# EAGLE design XMEGAbreakoutSMD (EAGLE 7.5.0)
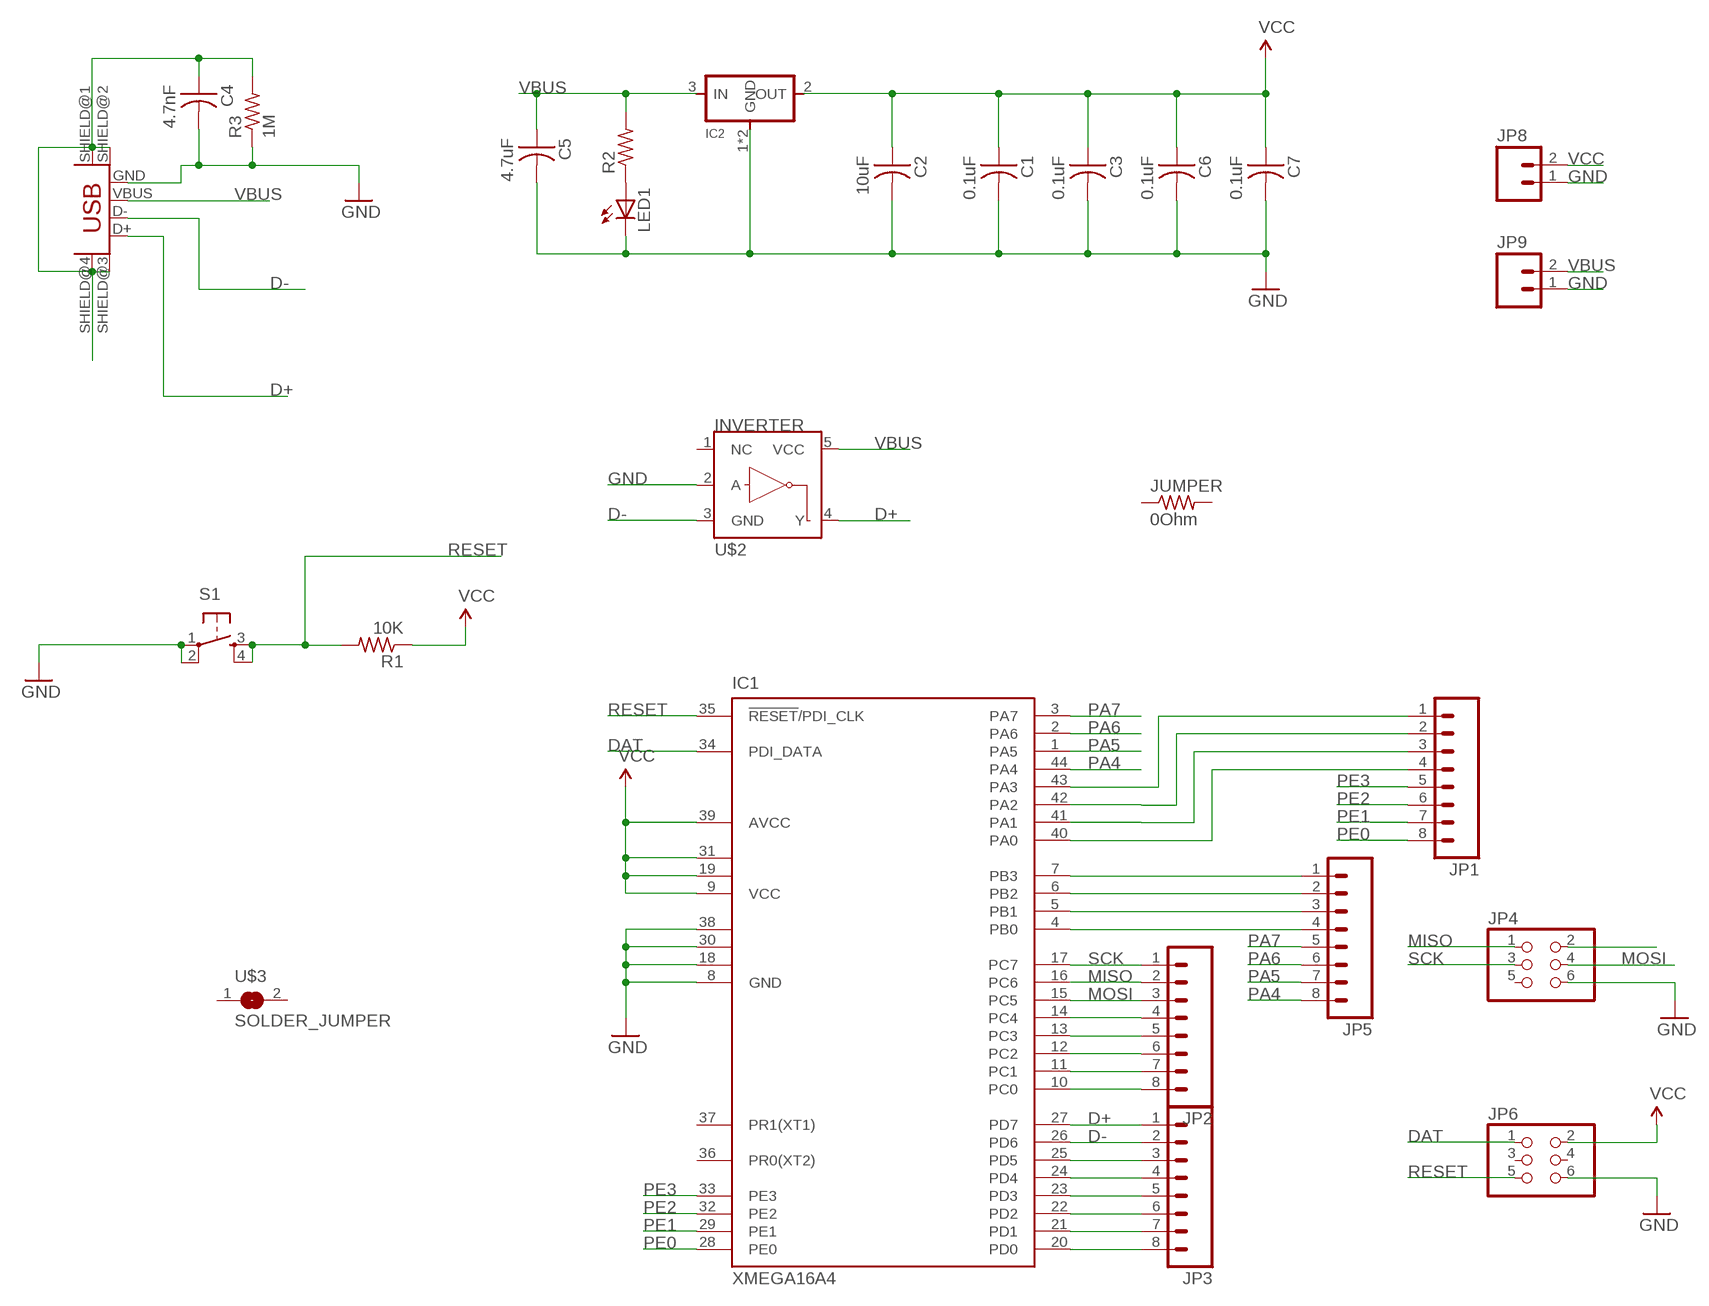
[diagram p0: schematic, sheet 1]

## Parts
C1  0.1uF  CAP-US1206  [C1206]
C2  10uF  CAP-US1206  [C1206]
C3  0.1uF  CAP-US1206FAB  [C1206FAB]
C4  4.7nF  CAP-US1206  [C1206]
C5  4.7uF  CAP-US1206  [C1206]
C6  0.1uF  CAP-US1206  [C1206]
C7  0.1uF  CAP-US1206  [C1206]
IC1  XMEGA16A4  [TQFP44-FAB]
IC2  REGULATORSOT223  [SOT223]
JP1  M08  [1X08_SMD_ALT_2X1X4]
JP2  M08SMD-STRAIGHT-ALT  [1X08_SMD_ALT]
JP3  M08SMD-STRAIGHT-ALT  [1X08_SMD_ALT]
JP4  PINHD-2X3-SMD  [2X03SMD]
JP5  M08SMD-STRAIGHT-ALT  [1X08_SMD_ALT]
JP6  PINHD-2X3-SMD  [2X03SMD]
JP8  M02  [1X02_SMD_STRAIGHT_ALT]
JP9  M02  [1X02_SMD_STRAIGHT_ALT]
JUMPER  0Ohm  RES-US1206FAB  [R1206FAB]
LED1  LEDSMT1206  [1206]
R1  10K  RES-US1206FAB  [R1206FAB]
R2  RES-US1206FAB  [R1206FAB]
R3  1M  RES-US1206FAB  [R1206FAB]
S1  6MM_SWITCH6MM_SWITCH  [6MM_SWITCH]
U$1  USB_MINIB  [USB_MINIB]
U$2  INVERTER  [SOT23-5]
U$3  SOLDER_JUMPER  [SJFAB]

## Nets
D+: IC1.27(PD7) JP3.1 U$1.D+ U$2.4(Y)
D-: IC1.26(PD6) JP3.2 U$1.D- U$2.3(GND)
DAT: IC1.34(PDI_DATA) JP6.1
GND: C1.2 C2.2 C3.2 C4.2 C5.2 C6.2 C7.2 IC1.8(GND) IC1.18(GND1) IC1.30(GND2) IC1.38(GND3) IC2.1(GND) IC2.4(GND) JP4.6 JP6.6 JP8.1 JP9.1 LED1.C R3.1 S1.1(P) S1.2(P1) U$1.GND U$2.2(A)
MISO: IC1.16(PC6) JP2.2 JP4.1
MOSI: IC1.15(PC5) JP2.3 JP4.4
N$5: IC1.43(PA3) JP1.1
N$6: IC1.42(PA2) JP1.2
N$7: IC1.41(PA1) JP1.3
N$8: IC1.40(PA0) JP1.4
N$9: IC1.7(PB3) JP5.1
N$10: IC1.6(PB2) JP5.2
N$11: IC1.5(PB1) JP5.3
N$12: IC1.14(PC4) JP2.4
N$13: IC1.13(PC3) JP2.5
N$14: IC1.12(PC2) JP2.6
N$15: IC1.11(PC1) JP2.7
N$16: IC1.10(PC0) JP2.8
N$17: JP4.2
N$18: IC1.4(PB0) JP5.4
N$19: IC1.25(PD5) JP3.3
N$20: IC1.24(PD4) JP3.4
N$21: IC1.23(PD3) JP3.5
N$22: IC1.22(PD2) JP3.6
N$23: IC1.21(PD1) JP3.7
N$24: IC1.20(PD0) JP3.8
N$25: C4.1 R3.2 U$1.SHIELD@1(SHIELD) U$1.SHIELD@2(SHIELD1) U$1.SHIELD@3(SHIELD2) U$1.SHIELD@4(SHIELD3)
N$26: LED1.A R2.1
PA4: IC1.44(PA4) JP5.8
PA5: IC1.1(PA5) JP5.7
PA6: IC1.2(PA6) JP5.6
PA7: IC1.3(PA7) JP5.5
PE0: IC1.28(PE0) JP1.8
PE1: IC1.29(PE1) JP1.7
PE2: IC1.32(PE2) JP1.6
PE3: IC1.33(PE3) JP1.5
RESET: IC1.35(!RESET!/PDI_CLK) JP6.5 R1.2 S1.3(S) S1.4(S1)
SCK: IC1.17(PC7) JP2.1 JP4.3
VBUS: C5.1 IC2.3(IN) JP9.2 R2.2 U$1.VBUS U$2.5(VCC)
VCC: C1.1 C2.1 C3.1 C6.1 C7.1 IC1.9(VCC) IC1.19(VCC1) IC1.31(VCC2) IC1.39(AVCC) IC2.2(OUT) JP6.2 JP8.2 R1.1
Unconnected: IC1.36(PR0(XT2)) IC1.37(PR1(XT1)) JP4.5 JP6.3 JP6.4 JUMPER.1 JUMPER.2 U$2.1(NC) U$3.1 U$3.2

## Library data of the parts
C1-C7 = fab:CAP-US
IC1 = atmel:XMEGA16A4: MICROCONTROLLER Features High-performance, Low-power 8/16-bit AVR XMEGA Microcontroller Non-Volatile Program and Data Memories - 16 KB - 128 KB of In-System Self-Programmable Flash - 4 KB - 8 KB Boot Code Section with Independent Lock Bits - 1 KB - 2 KB EEPROM - 2 KB - 8 KB Internal SRAM Peripheral Features - Four-channel DMA Controller with support for external requests - Eight-channel Event System - Five 16-bit Timer/Counters Three Timer/Counters with 4 Output Compare or Input Capture channels Two Timer/Counters with 2 Output Compare or Input Capture channels High-Resolution Extensions on all Timer/Counters Advanced Waveform Extension on one Timer/Counter - Five USARTs IrDA Extension on one USART - Two Two-Wire Interfaces with dual address match (I2C and SMBus compatible) - Two SPIs (Serial Peripheral Interfaces) peripherals - AES and DES Crypto Engine - 16-bit Real Time Counter with Separate Oscillator - One Twelve-channel, 12-bit, 2 Msps Analog to Digital Converter - One Two-channel, 12-bit, 1 Msps Digital to Analog Converter - Two Analog Comparators with Window compare function - External Interrupts on all General Purpose I/O pins - Programmable Watchdog Timer with Separate On-chip Ultra Low Power Oscillator Special Microcontroller Features - Power-on Reset and Programmable Brown-out Detection - Internal and External Clock Options with PLL - Programmable Multi-level Interrupt Controller - Sleep Modes: Idle, Power-down, Standby, Power-save, Extended Standby - Advanced Programming, Test and Debugging Interfaces PDI (Program and Debug Interface) for programming, test and debugging I/O and Packages - 34 Programmable I/O Lines - 44 - lead TQFP - 44 - pad VQFN/QFN - 49 - ball VFBGA Operating Voltage - 1.6 - 3.6V Speed performance - 0 - 12 MHz @ 1.6 - 3.6V - 0 - 32 MHz @ 2.7 - 3.6V Drawn by Dipl.-Ing. (FH) Robert Siegler Created: 27.05.09
IC2 = fab:REGULATOR
JP1-JP3 JP5 = SparkFun:M08: Header 8 Standard 8-pin 0.1" header. Use with straight break away headers (SKU : PRT-00116), right angle break away headers (PRT-00553), swiss pins (PRT-00743), machine pins (PRT-00117), and female headers (PRT-00115).
JP4 JP6 = fab:PINHD-2X3-SMD: PIN HEADER
JP8 JP9 = SparkFun:M02: Header 2 Standard 2-pin 0.1" header. Use with straight break away headers (SKU : PRT-00116), right angle break away headers (PRT-00553), swiss pins (PRT-00743), machine pins (PRT-00117), and female headers (PRT-00115). Molex polarized connector foot print use with SKU : PRT-08233 with associated crimp pins and housings.
JUMPER R1-R3 = fab:RES-US: Resistor (US Symbol) Variants with postfix FAB are widened to allow the routing of internal traces
LED1 = adafruit:LED: LED OSRAM: - CHIPLED LG R971, LG N971, LY N971, LG Q971, LY Q971, LO R971, LY R971 LH N974, LH R974 LS Q976, LO Q976, LY Q976 LO Q996 - Hyper CHIPLED LW Q18S LB Q993, LB Q99A, LB R99A - SideLED LS A670, LO A670, LY A670, LG A670, LP A670 LB A673, LV A673, LT A673, LW A673 LH A674 LY A675 LS A676, LA A676, LO A676, LY A676, LW A676 LS A679, LY A679, LG A679 - Hyper Micro SIDELED® LS Y876, LA Y876, LO Y876, LY Y876 LT Y87S - SmartLED LW L88C, LW L88S LB L89C, LB L89S, LG L890 LS L89K, LO L89K, LY L89K LS L896, LA L896, LO L896, LY L896 - TOPLED LS T670, LO T670, LY T670, LG T670, LP T670 LSG T670, LSP T670, LSY T670, LOP T670, LYG T670 LG T671, LOG T671, LSG T671 LB T673, LV T673, LT T673, LW T673 LH T674 LS T676, LA T676, LO T676, LY T676, LB T676, LH T676, LSB T676, LW T676 LB T67C, LV T67C, LT T67C, LS T67K, LO T67K, LY T67K, LW E67C LS E67B, LA E67B, LO E67B, LY E67B, LB E67C, LV E67C, LT E67C LW T67C LS T679, LY T679, LG T679 LS T770, LO T770, LY T770, LG T770, LP T770 LB T773, LV T773, LT T773, LW T773 LH T774 LS E675, LA E675, LY E675, LS T675 LS T776, LA T776, LO T776, LY T776, LB T776 LHGB T686 LT T68C, LB T68C - Hyper Mini TOPLED® LB M676 - Mini TOPLED Santana® LG M470 LS M47K, LO M47K, LY M47K Source: http://www.osram.convergy.de/
S1 = fab:6MM_SWITCH: OMRON SWITCH
U$1 = fab:USB_MINIB
U$2 = SparkFun:INVERTER: Single inverter, SOT23-5
U$3 = fab:SOLDER_JUMPER

## Board
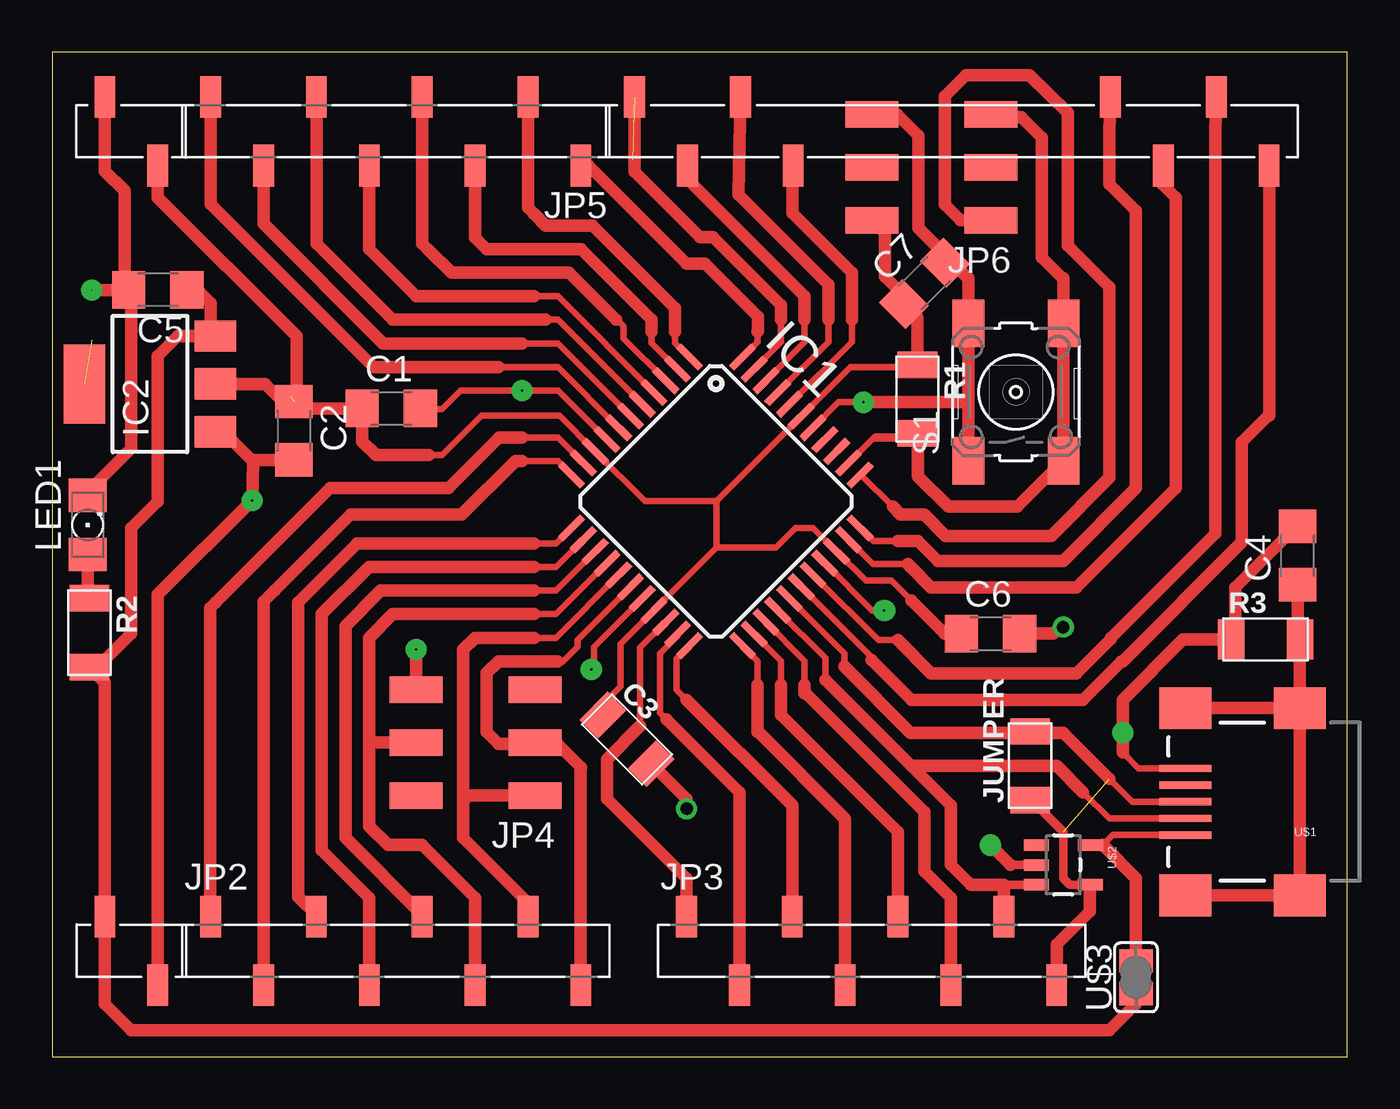
[diagram p1: board, top side]
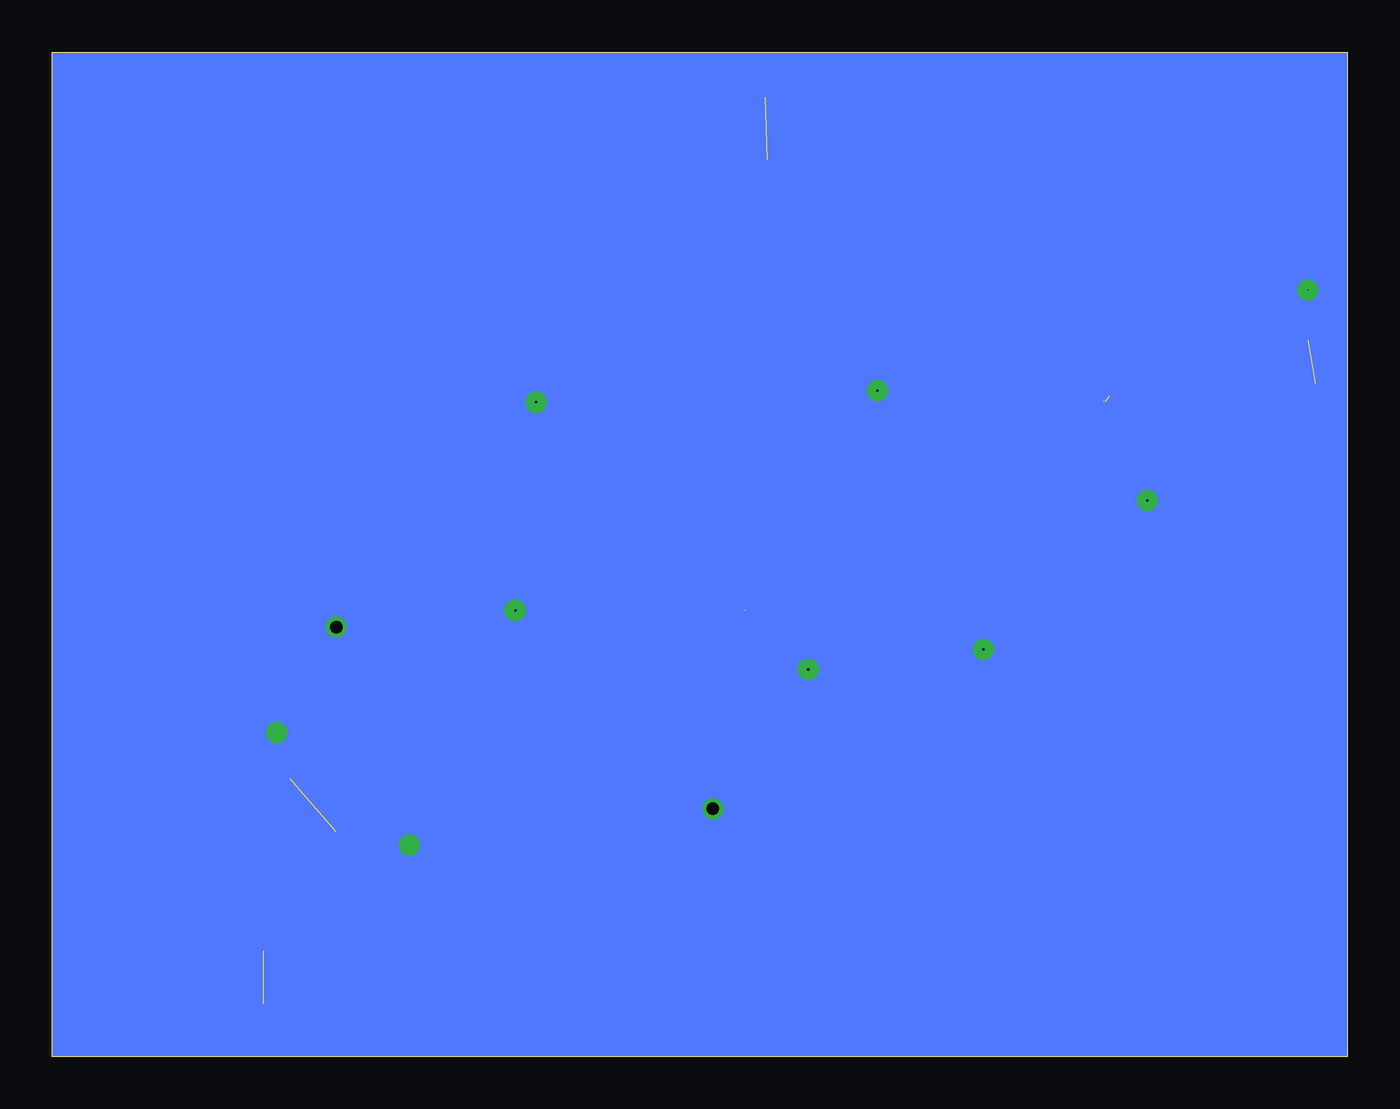
[diagram p2: board, bottom side, seen from below]

Size 62.23 x 48.26 mm. Coordinates in mm from the lower left corner, seen from the top.
Outline: 0,0 62.23,0 62.23,48.26 0,48.26 0,0
Copper layers (1*16): Top 0.035mm / dielectric 1.5mm / Bottom 0.035mm
Design rules "default": minimum track width 10mil, minimum drill 24mil, track to track 8mil, track to pad 8mil, pad to pad 8mil, via to via 8mil, smd to smd 8mil, copper to edge 40mil, drill to drill 8mil, minimum pad ring 10mil, minimum via ring 8mil, stop-mask expansion 4mil, vias tented up to drill 0mil, thermal gap 10mil

### Footprints (pad centres in the part's own frame; a part is rotated, then mirrored left to right if it is on the bottom)
C1206 = smd 1.6 x 1.8: 1 -1.4,0; 2 1.4,0
C1206FAB = smd 1.27 x 1.905: 1 -1.651,0; 2 1.651,0
TQFP44-FAB = smd 1.5 x 0.35: 1 -5.8,4; 2 -5.8,3.2; 3 -5.8,2.4; 4 -5.8,1.6; 5 -5.8,0.8; 6 -5.8,0; 7 -5.8,-0.8; 8 -5.8,-1.6; 9 -5.8,-2.4; 10 -5.8,-3.2; 11 -5.8,-4; 23 5.8,-4; 24 5.8,-3.2; 25 5.8,-2.4; 26 5.8,-1.6; 27 5.8,-0.8; 28 5.8,0; 29 5.8,0.8; 30 5.8,1.6; 31 5.8,2.4; 32 5.8,3.2; 33 5.8,4 | smd 0.35 x 1.5: 12 -4,-5.8; 13 -3.2,-5.8; 14 -2.4,-5.8; 15 -1.6,-5.8; 16 -0.8,-5.8; 17 0,-5.8; 18 0.8,-5.8; 19 1.6,-5.8; 20 2.4,-5.8; 21 3.2,-5.8; 22 4,-5.8; 34 4,5.8; 35 3.2,5.8; 36 2.4,5.8; 37 1.6,5.8; 38 0.8,5.8; 39 0,5.8; 40 -0.8,5.8; 41 -1.6,5.8; 42 -2.4,5.8; 43 -3.2,5.8; 44 -4,5.8
SOT223 = smd 1.5 x 2: 1 -2.3,-3.15; 2 0,-3.15; 3 2.3,-3.15 | smd 3.8 x 2: 4 0,3.15
1X08_SMD_ALT_2X1X4 = smd 1 x 2: 1 30.48,-1.65; 2 27.94,1.65; 3 25.4,-1.65; 4 22.86,1.65; 5 7.62,-1.65; 6 5.08,1.65; 7 2.54,-1.65; 8 0,1.65
1X08_SMD_ALT = smd 1 x 2: 1 0,-1.65; 2 -2.54,1.65; 3 -5.08,-1.65; 4 -7.62,1.65; 5 -10.16,-1.65; 6 -12.7,1.65; 7 -15.24,-1.65; 8 -17.78,1.65
2X03SMD = smd 2.54 x 1.27: 1 -2.857,2.54; 2 2.857,2.54; 3 -2.857,0; 4 2.857,0; 5 -2.857,-2.54; 6 2.857,-2.54
1X02_SMD_STRAIGHT_ALT = smd 1 x 2: 1 0,-1.65; 2 -2.54,1.65
R1206FAB = smd 1.27 x 1.905: 1 -1.651,0; 2 1.651,0
1206 = smd 1.6 x 1.803: A -1.422,0; C 1.422,0
6MM_SWITCH = smd 2.286 x 1.524: 1 -3.302,2.286; 2 3.302,2.286; 3 -3.302,-2.286; 4 3.302,-2.286
USB_MINIB = smd 2.5 x 0.35: D+ 3.77,0; D- 3.77,0.8; GND 3.77,-1.6; ID 3.77,-0.8; VBUS 3.77,1.6 | smd 2.5 x 2: SHIELD@1 -1.73,-4.5; SHIELD@2 -1.73,4.5; SHIELD@3 3.77,4.5; SHIELD@4 3.77,-4.5
SOT23-5 = smd 0.55 x 1.2: 1 -0.95,-1.3; 2 0,-1.3; 3 0.95,-1.3; 4 0.95,1.3; 5 -0.95,1.3
SJFAB = smd 1.118 x 1.6: 1 -0.787,0; 2 0.787,0

### Placement (x,y rotation side)
C1  16.3,31.14 0 top
C2  11.62,30.07 270 top
C3  27.62,15.24 315 top
C4  59.83,24.07 90 top
C5  5.08,36.83 180 top
C6  45.09,20.32 0 top
C7  41.91,37.15 45 top
IC1  31.89,26.67 315 top
IC2  4.7,32.32 90 top
JP1  58.46,44.45 180 top
JP2  25.4,5.08 0 top
JP3  48.26,5.08 0 top
JP4  20.34,15.09 180 top
JP5  7.62,44.45 180 top
JP6  42.25,42.71 180 top
JP8  2.54,44.45 180 top
JP9  5.08,5.08 0 top
JUMPER  46.99,13.97 90 top
LED1  1.71,25.54 90 top
R1  41.57,31.59 270 top
R2  1.8,20.37 270 top
R3  58.29,20.04 0 top
S1  46.3,31.93 90 top
U$1  58.2,12.24 180 top
U$2  48.58,9.21 270 top
U$3  52.07,3.81 90 top

### Tracks (layer width: path | path; a pad name or v marks a point on that pad's centre or on a via)
D+  (1 unrouted)
  Top 0.305: U$1.D+ 51.89,12.24 50.8,13.34 | 38.06,18.73 38.06,19.37 IC1.27
  Top 0.406: U$2.4 48.89,8.26 48.58,8.57 48.58,10.79 46.99,12.38
  Top 0.61: 50.8,13.34 48.58,15.56 41.24,15.56 38.06,18.73 | JP3.1 48.26,5.4 49.85,6.99 49.85,8.23 U$2.4
D-
  Top 0.305: 37.15,18.1 37.15,19.15 IC1.26 | U$1.D- 50.79,11.44 49.53,12.7
  Top 0.406: 45.72,8.26 U$2.3
  Top 0.61: 49.53,12.7 48.26,13.97 41.27,13.97 | 41.27,13.97 37.15,18.1 | 41.27,13.97 43.18,12.06 43.18,9.21 44.13,8.26 45.72,8.26 JP3.2
DAT
  Top 0.305: IC1.34 38.86,27.94 40.39,26.42
  Top 0.61: JP6.1 43.65,40.17 42.89,40.93 42.89,46.14 43.9,47.16 46.95,47.16 48.81,45.35 48.81,38.96 50.8,36.97 50.8,27.81 48.01,25.02 42.93,25.02 41.91,26.04 40.77,26.04 40.39,26.42
GND  (via drill 0 pad 1.02, 0.03 pad 1.02, 0.1 pad 1.02, 0.6)  (1 unrouted)
  Top 0.305: U$1.GND 52.2,13.84 51.44,14.61 | IC1.8 24.3,32 v22.58,32 19.62,32 18.73,31.11 17.72,31.11 C1.2 | IC1.18 26.54,20.19 26.04,19.68 26.04,18.73 v25.9,18.6 | IC1.30 39.39,21.43 v39.96,21.43 v40.01,21.43 | v38.98,31.43 37.79,31.43 IC1.38 | v40.01,21.43
  Top 0.406: 46.04,9.21 U$2.2
  Top 0.61: JP4.6 17.49,18.99 v17.49,19.55 | v38.98,31.43 39,31.45 44,31.45 44.02,31.43 | S1.1 44.02,31.43 | 44.02,31.43 S1.2 44.02,37.39 43.88,37.53 | LED1.C 1.55,27.12 1.72,27.12 3.81,29.21 3.81,36.7 C5.2 3.49,36.83 | 9.66,28.59 v9.61,26.72 5.08,22.19 JP9.1 | 51.44,14.61 v51.44,15.56 51.44,17.14 54.33,20.04 R3.1 56.83,20.23 56.83,22.54 59.76,25.47 C4.2 | 9.66,28.59 9.74,28.67 C2.2 | IC2.1 8.23,30.02 9.66,28.59 | v1.91,36.83 3.49,36.83 | 3.49,36.83 3.49,41.59 2.54,42.55 JP8.1 | 43.88,37.53 41.62,39.79 41.62,44.24 40.6,45.25 JP6.6 | 46.04,9.21 v45.09,10.16 | C7.2 43.27,38.14 43.88,37.53 | C3.2 28.79,13.76 29.11,13.76 30.48,12.38 v30.48,11.91 | v48.58,20.64 48.42,20.64 48.1,20.32 C6.2
  Bottom 0.305: v40.01,21.43 47.78,21.43 v48.58,20.64 37.8,20.64 37.71,20.55
  Bottom 0.406: v22.58,32 23.14,20.12 23.14,19.55 v25.9,18.6 25.97,16.73 33.89,16.73 34.3,17.14 37.71,20.55 37.85,20.69 | v39.96,21.43 41.25,29.74 40.96,30.02 39.39,31.14 v38.98,31.43 | v45.09,10.16 v51.44,15.56
  Bottom 0.61: 23.14,20.12 v17.49,19.55 11.83,24.65 v9.61,26.72 1.91,34.42 v1.91,36.83 | 54.61,19.37 51.44,19.37 | 51.44,19.37 51.17,19.37 49.24,21.3 | 49.24,21.3 39.39,31.14 | v51.44,15.56 51.44,19.37 | v30.48,11.91 30.48,13.31 34.3,17.14 | 49.24,21.3 v48.58,20.64 48.42,20.64
MISO
  Top 0.305: 23.14,20.12 24.21,20.12 IC1.16
  Top 0.61: 23.14,20.12 20.32,20.12 19.75,19.55 19.75,12.2 | 19.75,12.2 19.75,10.5 22.86,7.39 JP2.2 | JP4.1 19.97,12.55 19.75,12.2
MOSI
  Top 0.305: 23.14,21.25 24.21,21.25 IC1.15
  Top 0.61: 23.14,21.25 16.36,21.25 15.22,20.12 15.22,15.03 | 15.22,15.03 15.22,11.07 16.13,10.16 17.78,10.16 20.32,7.62 JP2.3 | JP4.4 15.28,15.09 15.22,15.03
N$5  (1 unrouted)
  Top 0.305: 35.02,35.39 35.02,34.33 IC1.43
  Top 0.61: 35.02,35.39 35.02,36.1 31.75,39.37 31.11,39.37 27.98,42.5 JP1.1
N$6
  Top 0.305: 36.16,35.39 36.16,34.33 IC1.42
  Top 0.61: 36.16,35.39 36.16,36.53 30.43,42.24 JP1.2
N$7
  Top 0.305: 37.29,35.39 37.29,34.33 IC1.41
  Top 0.61: 37.29,35.39 37.29,37.09 32.98,41.4 JP1.3
N$8
  Top 0.305: 38.42,35.39 38.42,34.33 IC1.40
  Top 0.61: 38.42,35.39 38.42,37.66 35.56,40.51 35.56,42.76 JP1.4
N$9
  Top 0.305: 21.45,33.13 24.3,33.13 IC1.7
  Top 0.61: 21.45,33.13 15.45,33.13 7.62,40.96 JP5.1
N$10
  Top 0.305: 22.58,34.26 24.3,34.26 IC1.6
  Top 0.61: JP5.2 10.15,42.79 10.16,42.77 10.16,40.01 15.9,34.26 22.58,34.26
N$11
  Top 0.305: 23.71,35.39 24.3,35.39 IC1.5
  Top 0.61: 23.71,35.39 16.36,35.39 12.7,39.05 JP5.3
N$12
  Top 0.305: 23.14,22.38 24.21,22.38 IC1.14
  Top 0.61: 23.14,22.38 15.79,22.38 14.09,20.69 14.09,10.5 17.78,6.82 JP2.4
N$13
  Top 0.305: 23.14,23.52 24.21,23.52 IC1.13
  Top 0.61: 23.14,23.52 15.22,23.52 12.96,21.25 12.96,9.9 15.24,7.62 JP2.5
N$14
  Top 0.305: 23.14,24.65 24.21,24.65 IC1.12
  Top 0.61: 23.14,24.65 14.66,24.65 11.83,21.82 11.83,7.68 12.7,6.81 JP2.6 | JP2.6
N$15
  Top 0.305: 22.58,28.61 24.3,28.61 IC1.11
  Top 0.61: 10.7,22.38 | 10.7,22.38 10.69,22.38 10.17,21.86 10.17,3.82 JP2.7 | 22.58,28.61 22.26,28.61 19.68,26.04 14.35,26.04 10.7,22.38
N$16
  Top 0.305: 22.58,29.74 24.3,29.74 IC1.10
  Top 0.61: JP2.8 7.61,6.75 7.61,21.55 7.87,21.81 7.87,21.82 13.36,27.3 19.05,27.3 21.48,29.74 22.58,29.74
N$18
  Top 0.305: 23.14,36.53 24.3,36.53 IC1.4
  Top 0.61: 23.14,36.53 17.49,36.53 15.22,38.79 15.22,40.24 JP5.4
N$19
  Top 0.305: 36.16,17.86 36.16,19.01 IC1.25
  Top 0.61: 36.16,17.86 36.16,17.45 36.21,17.45 41.91,11.75 41.91,8.89 43.18,7.62 JP3.3 43.17,3.82
N$20
  Top 0.305: 35.02,17.86 35.02,19.01 IC1.24
  Top 0.61: 35.02,17.86 35.02,16.41 40.64,10.79 40.64,9.86 40.63,9.85 40.63,6.74 JP3.4
N$21
  Top 0.305: 33.89,17.86 33.89,19.01 IC1.23
  Top 0.61: 33.89,17.86 33.89,15.6 33.93,15.6 38.1,11.43 38.1,10.47 38.09,10.46 38.09,3.82 JP3.5
N$22
  Top 0.305: IC1.22 30,19.13 30,17.62 30.48,17.14
  Top 0.61: JP3.6 35.57,10.94 35.56,10.95 35.56,12.06 30.48,17.14
N$23
  Top 0.305: IC1.21 30.05,20.21 29.21,19.37 29.21,16.51 29.53,16.19
  Top 0.61: JP3.7 33.02,3.81 33.02,10.4 33.02,11.75 33.02,12.7 29.53,16.19
N$24
  Top 0.305: 28.26,15.88 28.26,19.64 IC1.20
  Top 0.61: JP3.8 30.48,8.57 26.67,12.38 26.67,14.29 28.26,15.88
N$25
  Top 0.61: U$1.SHIELD@3 U$1.SHIELD@2 U$1.SHIELD@1 | U$1.SHIELD@1 U$1.SHIELD@4 | U$1.SHIELD@4 53.89,16.74 53.66,16.51 54.2,16.51 U$1.SHIELD@4 | 59.88,20.11 R3.2 | R3.2 59.94,16.76 U$1.SHIELD@1 | 53.89,17.29 U$1.SHIELD@4 | C4.1 59.83,20.15 R3.2
N$26
  Top 0.61: LED1.A 1.72,22.1 R2.1
PA4
  Top 0.305: 33.89,34.83 33.89,34.33 IC1.44
  Top 0.61: 33.89,34.83 33.91,34.85 33.91,35.56 31.37,38.1 30.48,38.1 25.78,42.8 JP5.8
PA5
  Top 0.305: 29.93,34.83 29.93,34.28 IC1.1
  Top 0.61: 29.93,34.83 29.93,35.96 25.97,39.92 23.71,39.92 23.14,40.49 | 23.14,40.49 23.12,40.49 | 23.14,40.49 22.87,40.77 22.86,40.77 JP5.7
PA6
  Top 0.305: 28.8,34.83 28.8,34.28 IC1.2
  Top 0.61: 28.8,34.83 28.8,35.39 25.41,38.79 20.88,38.79 20.88,38.8 20.33,39.35 JP5.6
PA7
  Top 0.305: 27.1,35.39 27.15,35.39 27.46,35.08 27.46,34.49 IC1.3
  Top 0.61: 27.1,35.39 24.84,37.66 19.18,37.66 18.05,38.79 17.78,39.05 JP5.5
PE0
  Top 0.305: IC1.28 39.37,19.19 39.37,19.05
  Top 0.61: JP1.8 58.47,30.8 58.42,30.8 57.15,29.53 57.15,24.71 51.43,18.99 51.38,18.99 49.53,17.14 41.27,17.14 39.37,19.05
PE1
  Top 0.305: 40.64,20 39.69,20 | 39.69,20 | 39.69,20 IC1.29
  Top 0.61: JP1.7 55.88,44.41 55.88,25.14 50.86,20.12 50.86,20.07 49.21,18.41 42.23,18.41 40.64,20
PE2
  Top 0.305: IC1.32 39.43,23.65 41.12,23.65
  Top 0.61: JP1.6 53.34,42.76 53.34,41.91 53.98,41.27 53.98,27.3 49.21,22.54 42.23,22.54 41.26,23.52 41.25,23.52 41.12,23.65
PE3
  Top 0.305: 40.64,24.77 39.45,24.77 IC1.33
  Top 0.61: JP1.5 50.8,44.41 50.8,41.91 52.07,40.64 52.07,27.3 48.58,23.81 42.55,23.81 41.59,24.77 40.64,24.77
RESET
  Top 0.305: 39.55,29.74 39.48,29.74 IC1.35 | 41.59,29.92 R1.2
  Top 0.406: 39.55,29.74 41.38,29.74 R1.2
  Top 0.61: 41.59,29.92 41.59,27.88 43.05,26.42 46.38,26.42 S1.3 S1.4 48.59,37.39 48.54,37.39 47.55,38.38 47.55,44.15 46.57,45.12 45.24,45.12 JP6.5
SCK
  Top 0.305: 24.27,18.99 24.55,18.99 25.24,19.68 25.24,20.02 IC1.17
  Top 0.61: 24.27,18.99 21.45,18.99 20.88,18.42 20.88,15.6 21.45,15.03 23.15,15.03 | 23.15,15.03 JP4.3 | 23.15,15.03 24.27,15.03 25.41,13.9 25.4,13.9 JP2.1
VBUS  (1 unrouted)
  Top 0.305: U$1.VBUS 50.97,10.64 50.48,10.16 U$2.5
  Top 0.61: C5.1 6.48,36.7 7.12,36.7 7.62,36.2 7.62,34.85 IC2.3 6.04,34.62 5.08,33.66 5.08,26.67 3.81,25.4 3.81,20.32 2.21,18.72 R2.2 2.54,17.98 JP9.2 2.54,2.54 3.81,1.27 50.8,1.27 52.07,2.54 | 50.48,10.16 52.07,8.57 52.07,5.08
VCC  (3 unrouted)
  Top 0.305: 41.47,33.13 38.35,33.13 IC1.39 31.91,26.69 | 28.92,21.46 31.91,24.45 | 31.91,24.45 31.91,26.69 | 31.91,24.45 34.77,24.45 35.72,25.4 36.55,25.4 IC1.31 39.09,22.86 40.32,22.86 41.27,21.91 | 31.91,26.69 28.48,26.69 IC1.9 24.37,30.8 20.64,30.8 18.73,28.89 18.1,28.89 | C3.1 26.45,16.93 27.3,17.78 27.3,19.82 IC1.19
  Top 0.406: 41.47,33.13 R1.1 | 11.43,31.72 11.43,31.11
  Top 0.61: IC2.2 10.23,32.32 11.43,31.11 | JP8.2 5.08,41.27 11.75,34.61 11.75,31.49 | R1.1 41.58,35.5 C7.1 40.92,36.55 40.01,37.47 40.01,39.56 JP6.2 | C6.1 42.86,20.32 41.27,21.91 | 18.1,28.89 15.56,28.89 14.9,29.55 C1.1 11.95,31.14 C2.1
(copper drawn outside any net)
  shapes: Bottom area x1